# EAGLE design Button Board (EAGLE 9.4.2)
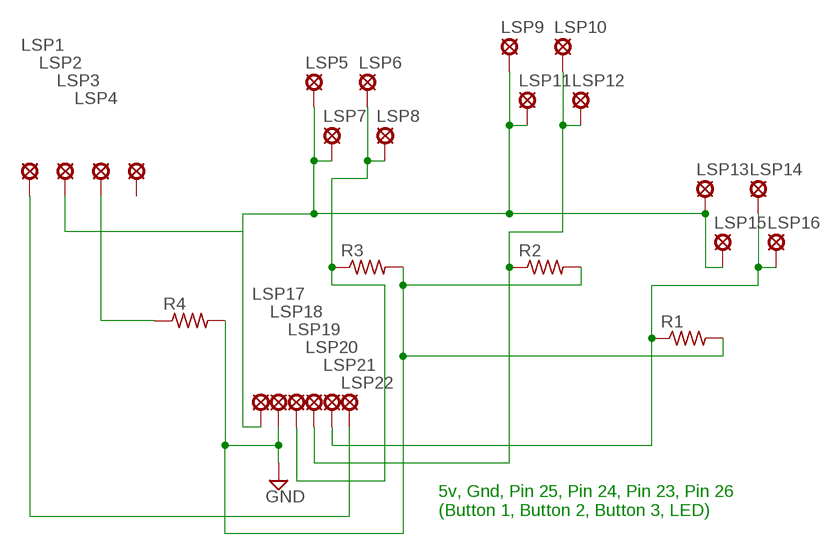
[diagram p0: schematic, sheet 1]

## Parts
LSP1  LSP10_CLSP10_C  [LSP10_C]
LSP2  LSP10_CLSP10_C  [LSP10_C]
LSP3  LSP10_CLSP10_C  [LSP10_C]
LSP4  LSP10_CLSP10_C  [LSP10_C]
LSP5  LSP10_CLSP10_C  [LSP10_C]
LSP6  LSP10_CLSP10_C  [LSP10_C]
LSP7  LSP10_CLSP10_C  [LSP10_C]
LSP8  LSP10_CLSP10_C  [LSP10_C]
LSP9  LSP10_CLSP10_C  [LSP10_C]
LSP10  LSP10_CLSP10_C  [LSP10_C]
LSP11  LSP10_CLSP10_C  [LSP10_C]
LSP12  LSP10_CLSP10_C  [LSP10_C]
LSP13  LSP10_CLSP10_C  [LSP10_C]
LSP14  LSP10_CLSP10_C  [LSP10_C]
LSP15  LSP10_CLSP10_C  [LSP10_C]
LSP16  LSP10_CLSP10_C  [LSP10_C]
LSP17  LSP10_CLSP10_C  [LSP10_C]
LSP18  LSP10_CLSP10_C  [LSP10_C]
LSP19  LSP10_CLSP10_C  [LSP10_C]
LSP20  LSP10_CLSP10_C  [LSP10_C]
LSP21  LSP10_CLSP10_C  [LSP10_C]
LSP22  LSP10_CLSP10_C  [LSP10_C]
R1  R-US_VMTA55  [VMTA55]
R2  R-US_VMTA55  [VMTA55]
R3  R-US_VMTA55  [VMTA55]
R4  R-US_VMTA55  [VMTA55]

## Nets
GND: LSP18.P$1(MP) R1.2 R2.2 R3.2 R4.2
N$2: LSP6.P$1(MP) LSP8.P$1(MP) LSP19.P$1(MP) R3.1
N$3: LSP3.P$1(MP) R4.1
N$4: LSP10.P$1(MP) LSP12.P$1(MP) LSP20.P$1(MP) R2.1
N$5: LSP2.P$1(MP) LSP5.P$1(MP) LSP7.P$1(MP) LSP9.P$1(MP) LSP11.P$1(MP) LSP13.P$1(MP) LSP15.P$1(MP) LSP17.P$1(MP)
N$6: LSP14.P$1(MP) LSP16.P$1(MP) LSP21.P$1(MP) R1.1
N$7: LSP1.P$1(MP) LSP22.P$1(MP)
Unconnected: LSP4.P$1(MP)

## Notes on the sheet
- 5v, Gnd, Pin 25, Pin 24, Pin 23, Pin 26
  (Button 1, Button 2, Button 3, LED)

## Library data of the parts
LSP1-LSP22 = tbtaco-solpad:LSP10_C: SOLDER PAD drill 1.0 mm, distributor Buerklin, 12H555
R1-R4 = rcl:R-US_: RESISTOR, American symbol; SPICEPREFIX: R

## Board
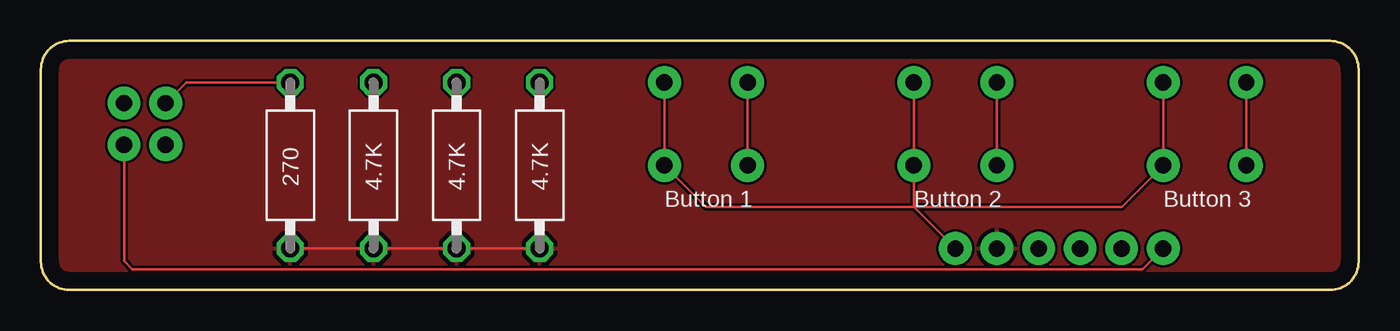
[diagram p1: board, top side]
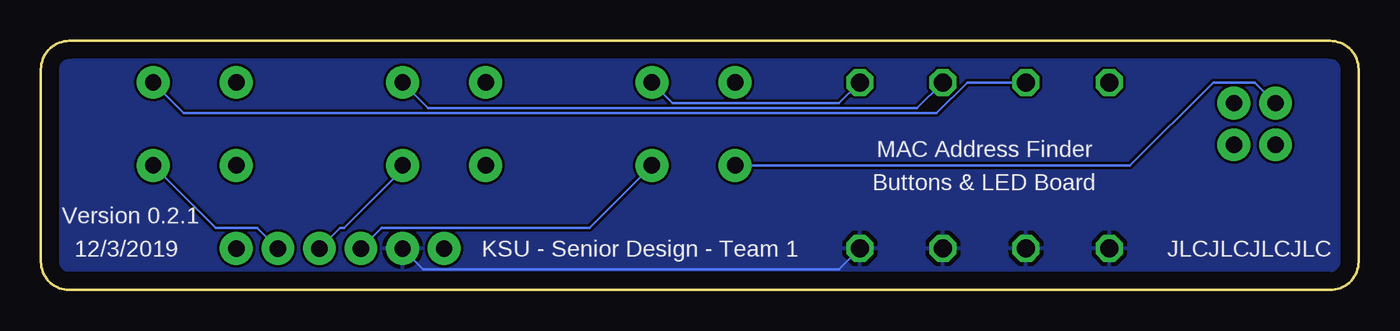
[diagram p2: board, bottom side, seen from below]

Size 80.52 x 15.24 mm. Coordinates in mm from the lower left corner, seen from the top.
Outline: 1.73,0 78.78,0 arc90 80.52,1.73 80.52,13.51 arc90 78.78,15.24 1.73,15.24 arc90 0,13.51 0,1.73 arc90 1.73,0
Copper layers (1*16): Top 0.035mm / dielectric 1.5mm / Bottom 0.035mm
Design rules "default": minimum track width 6mil, minimum drill 0.35mm, track to track 6mil, track to pad 6mil, pad to pad 6mil, via to via 6mil, smd to smd 6mil, copper to edge 40mil, drill to drill 6mil, minimum pad ring 10mil, minimum via ring 8mil, stop-mask expansion 4mil, vias tented up to drill 0mil, thermal gap 10mil

### Footprints (pad centres in the part's own frame; a part is rotated, then mirrored left to right if it is on the bottom)
LSP10_C = drill 1 pad 2: P$1 0,0
VMTA55 = drill 1.1 octagon: 1 -5.08,0; 2 5.08,0

### Placement (x,y rotation side)
LSP1  5.08,8.89 0 top
LSP2  5.08,11.43 0 top
LSP3  7.62,11.43 0 top
LSP4  7.62,8.89 0 top
LSP5  38.1,12.7 0 top
LSP6  43.18,12.7 0 top
LSP7  38.1,7.62 0 top
LSP8  43.18,7.62 0 top
LSP9  53.34,12.7 0 top
LSP10  58.42,12.7 0 top
LSP11  53.34,7.62 0 top
LSP12  58.42,7.62 0 top
LSP13  68.58,12.7 0 top
LSP14  73.66,12.7 0 top
LSP15  68.58,7.62 0 top
LSP16  73.66,7.62 0 top
LSP17  55.88,2.54 0 top
LSP18  58.42,2.54 0 top
LSP19  60.96,2.54 0 top
LSP20  63.5,2.54 0 top
LSP21  66.04,2.54 0 top
LSP22  68.58,2.54 0 top
R1  20.32,7.62 270 top
R2  25.4,7.62 270 top
R3  30.48,7.62 270 top
R4  15.24,7.62 270 top

### Tracks (layer width: path | path; a pad name or v marks a point on that pad's centre or on a via)
GND
  Top 0.152: R4.2 R1.2 R2.2 R3.2
  Bottom 0.152: LSP18.P$1 57.15,1.27 31.75,1.27 R3.2
  pour Top: 0,0 0,15.24 80.52,15.24 80.52,0
  pour Bottom: 0,0 0,15.24 80.52,15.24 80.52,0
N$2
  Top 0.152: LSP6.P$1 LSP8.P$1
  Bottom 0.152: R3.1 31.75,11.43 41.91,11.43 LSP6.P$1 | LSP8.P$1 46.99,3.81 59.69,3.81 LSP19.P$1
N$3
  Top 0.152: R4.1 8.89,12.7 LSP3.P$1
N$4
  Top 0.152: LSP10.P$1 LSP12.P$1
  Bottom 0.152: R2.1 26.98,11.12 56.84,11.12 LSP10.P$1 | LSP20.P$1 62.23,3.81 61.98,3.81 58.42,7.37 LSP12.P$1
N$5
  Top 0.152: LSP13.P$1 LSP15.P$1 66.04,5.08 53.34,5.08 | LSP9.P$1 LSP11.P$1 53.34,5.08 | LSP5.P$1 LSP7.P$1 40.64,5.08 53.34,5.08 | LSP17.P$1 53.34,5.08
  Bottom 0.152: LSP2.P$1 6.35,12.7 8.89,12.7 13.97,7.62 LSP7.P$1
N$6
  Top 0.152: LSP14.P$1 LSP16.P$1
  Bottom 0.152: R1.1 23.91,12.7 25.79,10.82 71.78,10.82 LSP14.P$1 | LSP21.P$1 67.31,3.81 69.85,3.81 LSP16.P$1
N$7
  Top 0.152: LSP22.P$1 67.31,1.27 5.59,1.27 5.08,1.78 LSP1.P$1

### Text on the board
tPlace: 270 | 4.7K | 4.7K | 4.7K | Button 1 | Button 2 | Button 3
bPlace: MAC Address Finder | Buttons & LED Board | Version 0.2.1 | JLCJLCJLCJLC | KSU - Senior Design - Team 1 | 12/3/2019